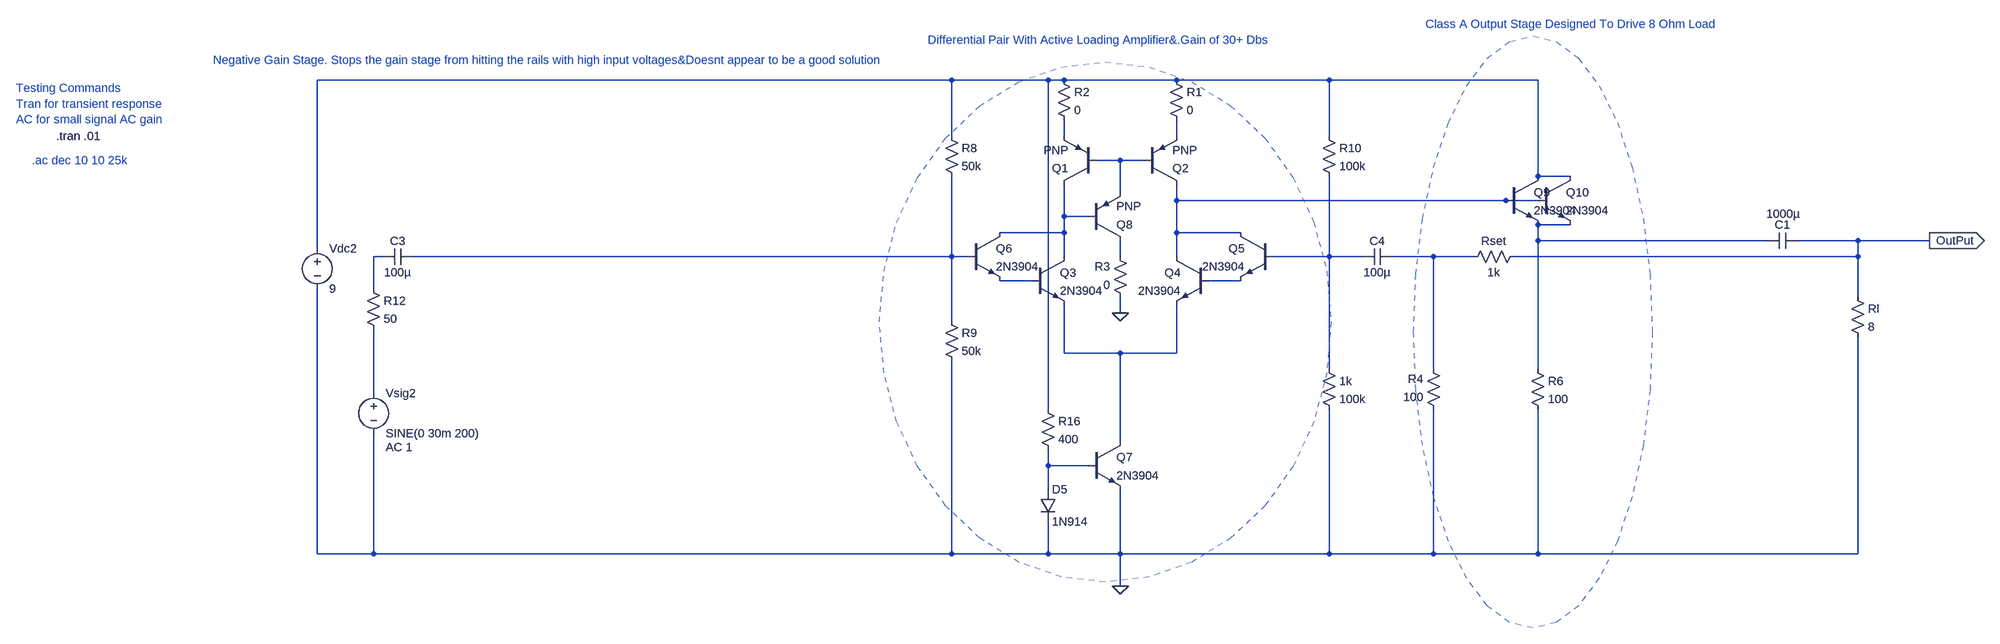
[diagram p0: schematic DifferPairWithActiveLoading.asc]
DifferPairWithActiveLoading.asc, the LTspice schematic file:
Version 4
SHEET 1 1204 1016
WIRE -2976 -80 -4240 -80
WIRE -2784 -80 -2976 -80
WIRE -2752 -80 -2784 -80
WIRE -2528 -80 -2752 -80
WIRE -2224 -80 -2528 -80
WIRE -1808 -80 -2224 -80
WIRE -2976 32 -2976 -80
WIRE -2752 32 -2752 0
WIRE -2528 32 -2528 0
WIRE -2224 32 -2224 -80
WIRE -2640 80 -2688 80
WIRE -2592 80 -2640 80
WIRE -1808 112 -1808 -80
WIRE -1744 112 -1808 112
WIRE -2640 144 -2640 80
WIRE -2528 160 -2528 128
WIRE -2192 160 -2528 160
WIRE -1872 160 -2192 160
WIRE -1808 160 -1872 160
WIRE -2752 192 -2752 128
WIRE -2704 192 -2752 192
WIRE -1744 208 -1808 208
WIRE -2752 224 -2752 192
WIRE -2752 224 -2880 224
WIRE -2528 224 -2528 160
WIRE -2400 224 -2528 224
WIRE -1808 240 -1808 208
WIRE -1296 240 -1808 240
WIRE -1104 240 -1232 240
WIRE -896 240 -1104 240
WIRE -4240 256 -4240 -80
WIRE -4112 272 -4128 272
WIRE -2976 272 -2976 112
WIRE -2976 272 -4048 272
WIRE -2944 272 -2976 272
WIRE -2752 272 -2752 224
WIRE -2640 272 -2640 240
WIRE -2528 272 -2528 224
WIRE -2288 272 -2336 272
WIRE -2224 272 -2224 112
WIRE -2224 272 -2288 272
WIRE -2160 272 -2224 272
WIRE -2016 272 -2096 272
WIRE -1936 272 -2016 272
WIRE -1104 272 -1104 240
WIRE -1104 272 -1856 272
WIRE -2816 320 -2880 320
WIRE -2400 320 -2464 320
WIRE -4128 336 -4128 272
WIRE -1104 352 -1104 272
WIRE -2640 384 -2640 352
WIRE -2976 400 -2976 272
WIRE -2752 464 -2752 368
WIRE -2688 464 -2752 464
WIRE -2640 464 -2688 464
WIRE -2528 464 -2528 368
WIRE -2528 464 -2640 464
WIRE -2224 496 -2224 272
WIRE -2016 496 -2016 272
WIRE -1808 496 -1808 240
WIRE -4128 544 -4128 416
WIRE -2784 576 -2784 -80
WIRE -2640 640 -2640 464
WIRE -2784 688 -2784 656
WIRE -2704 688 -2784 688
WIRE -2784 736 -2784 688
WIRE -4240 864 -4240 336
WIRE -4128 864 -4128 624
WIRE -4128 864 -4240 864
WIRE -2976 864 -2976 480
WIRE -2976 864 -4128 864
WIRE -2784 864 -2784 800
WIRE -2784 864 -2976 864
WIRE -2640 864 -2640 736
WIRE -2640 864 -2784 864
WIRE -2224 864 -2224 576
WIRE -2224 864 -2640 864
WIRE -2016 864 -2016 576
WIRE -2016 864 -2224 864
WIRE -1808 864 -1808 576
WIRE -1808 864 -2016 864
WIRE -1104 864 -1104 432
WIRE -1104 864 -1808 864
WIRE -2640 928 -2640 864
FLAG -2640 928 0
FLAG -2640 384 0
FLAG -896 240 OutPut
IOPIN -896 240 Out
DATAFLAG -2288 272 ""
DATAFLAG -2688 464 ""
DATAFLAG -2192 160 "$"
DATAFLAG -2976 272 "$"
SYMBOL npn -2816 272 R0
SYMATTR InstName Q3
SYMATTR Value 2N3904
SYMBOL npn -2464 272 M0
SYMATTR InstName Q4
SYMATTR Value 2N3904
SYMBOL npn -2336 224 M0
SYMATTR InstName Q5
SYMATTR Value 2N3904
SYMBOL npn -2944 224 R0
SYMATTR InstName Q6
SYMATTR Value 2N3904
SYMBOL voltage -4240 240 R0
WINDOW 123 0 0 Left 2
WINDOW 39 0 0 Left 2
SYMATTR InstName Vdc2
SYMATTR Value 9
SYMBOL cap -4048 256 R90
WINDOW 0 0 32 VBottom 2
WINDOW 3 32 32 VTop 2
SYMATTR InstName C3
SYMATTR Value 100µ
SYMBOL voltage -4128 528 R0
WINDOW 123 24 124 Left 2
WINDOW 39 0 0 Left 2
SYMATTR Value2 AC 1
SYMATTR InstName Vsig2
SYMATTR Value SINE(0 30m 200)
SYMBOL res -2992 16 R0
SYMATTR InstName R8
SYMATTR Value 50k
SYMBOL res -2992 384 R0
SYMATTR InstName R9
SYMATTR Value 50k
SYMBOL cap -2096 256 R90
WINDOW 0 0 32 VBottom 2
WINDOW 3 32 32 VTop 2
SYMATTR InstName C4
SYMATTR Value 100µ
SYMBOL res -2240 16 R0
SYMATTR InstName R10
SYMATTR Value 100k
SYMBOL res -2240 480 R0
SYMATTR InstName 1k
SYMATTR Value 100k
SYMBOL res -4144 320 R0
SYMATTR InstName R12
SYMATTR Value 50
SYMBOL npn -2704 640 R0
SYMATTR InstName Q7
SYMATTR Value 2N3904
SYMBOL diode -2800 736 R0
SYMATTR InstName D5
SYMATTR Value 1N914
SYMBOL res -2800 560 R0
SYMATTR InstName R16
SYMATTR Value 400
SYMBOL pnp -2688 128 R180
SYMATTR InstName Q1
SYMBOL pnp -2592 128 M180
SYMATTR InstName Q2
SYMBOL res -2544 -96 R0
SYMATTR InstName R1
SYMATTR Value 0
SYMBOL res -2768 -96 R0
SYMATTR InstName R2
SYMATTR Value 0
SYMBOL pnp -2704 240 M180
SYMATTR InstName Q8
SYMBOL res -1120 336 R0
SYMATTR InstName Rl
SYMATTR Value 8
SYMBOL cap -1232 224 R90
WINDOW 0 0 32 VBottom 2
WINDOW 3 -53 30 VTop 2
SYMATTR InstName C1
SYMATTR Value 1000µ
SYMBOL res -1824 480 R0
SYMATTR InstName R6
SYMATTR Value 100
SYMBOL npn -1872 112 R0
SYMATTR InstName Q9
SYMATTR Value 2N3904
SYMBOL res -1840 256 R90
WINDOW 0 0 56 VBottom 2
WINDOW 3 32 56 VTop 2
SYMATTR InstName Rset
SYMATTR Value 1k
SYMBOL res -2000 592 R180
WINDOW 0 36 76 Left 2
WINDOW 3 36 40 Left 2
SYMATTR InstName R4
SYMATTR Value 100
SYMBOL npn -1808 112 R0
SYMATTR InstName Q10
SYMATTR Value 2N3904
SYMBOL res -2624 368 R180
WINDOW 0 36 76 Left 2
WINDOW 3 36 40 Left 2
SYMATTR InstName R3
SYMATTR Value 0
TEXT -4912 32 Left 2 !.tran .01
TEXT -4960 80 Left 2 ;.ac dec 10 10 25k
TEXT -4448 -120 Left 2 ;Negative Gain Stage. Stops the gain stage from hitting the rails with high input voltages&Doesnt appear to be a good solution
TEXT -3024 -160 Left 2 ;Differential Pair With Active Loading Amplifier&.Gain of 30+ Dbs
TEXT -2032 -192 Left 2 ;Class A Output Stage Designed To Drive 8 Ohm Load
TEXT -4992 -64 Left 2 ;Testing Commands\nTran for transient response\nAC for small signal AC gain
CIRCLE Normal -3120 -116 -2220 920 2
CIRCLE Normal -2056 -168 -1580 1012 2

The netlist it stands for:
* DifferPairWithActiveLoading.asc
Q3 N006 N013 N015 0 2N3904
Q4 N005 N014 N015 0 2N3904
Q5 N005 N011 N014 0 2N3904
Q6 N006 N009 N013 0 2N3904
Vdc2 N001 0 9
C3 N009 N008 100µ
Vsig2 N016 0 SINE(0 30m 200) AC 1
R8 N001 N009 50k
R9 N009 0 50k
C4 N012 N011 100µ
R10 N001 N011 100k
R§1k N011 0 100k
R12 N008 N016 50
Q7 N015 N017 0 0 2N3904
D5 N017 0 1N914
R16 N001 N017 400
Q1 N006 N004 N002 0 PNP
Q2 N005 N004 N003 0 PNP
R1 N001 N003 0
R2 N001 N002 0
Q8 N010 N006 N004 0 PNP
Rl OutPut 0 8
C1 OutPut N007 1000µ
R6 N007 0 100
Q9 N001 N005 N007 0 2N3904
Rset OutPut N012 1k
R4 0 N012 100
Q10 N001 N005 N007 0 2N3904
R3 0 N010 0
.model D D
.lib standard.dio
.model NPN NPN
.model PNP PNP
.lib standard.bjt
.tran .01
* .ac dec 10 10 25k
* Negative Gain Stage. Stops the gain stage from hitting the rails with high input voltages&Doesnt appear to be a good solution
* Differential Pair With Active Loading Amplifier&.Gain of 30+ Dbs
* Class A Output Stage Designed To Drive 8 Ohm Load
* Testing Commands
* Tran for transient response
* AC for small signal AC gain
.backanno
.end